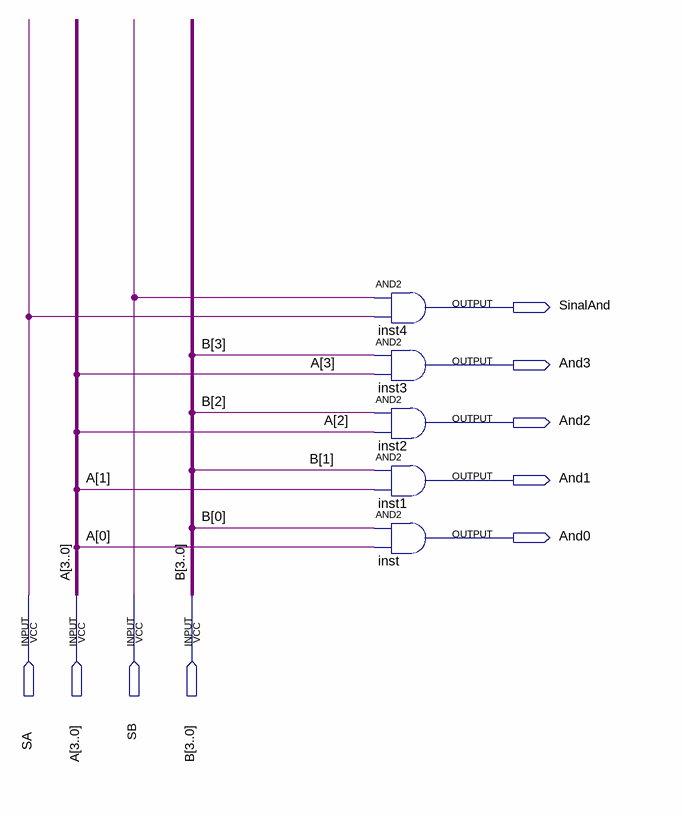
[diagram p0: schematic sheet]
// Quartus schematic CircuitoAnd (1).bdf as structural Verilog: 5 symbols, 9 pins
module \CircuitoAnd_(1)  (
  input  SA,
  input  [3:0] A,
  input  SB,
  input  [3:0] B,
  output SinalAnd,
  output And3,
  output And2,
  output And1,
  output And0
);

  and inst4 (SinalAnd, SB, SA);
  and inst3 (And3, B[3], A[3]);
  and inst2 (And2, B[2], A[2]);
  and inst1 (And1, B[1], A[1]);
  and inst (And0, B[0], A[0]);
endmodule
